# Altium project RFStamp.PrjPcb
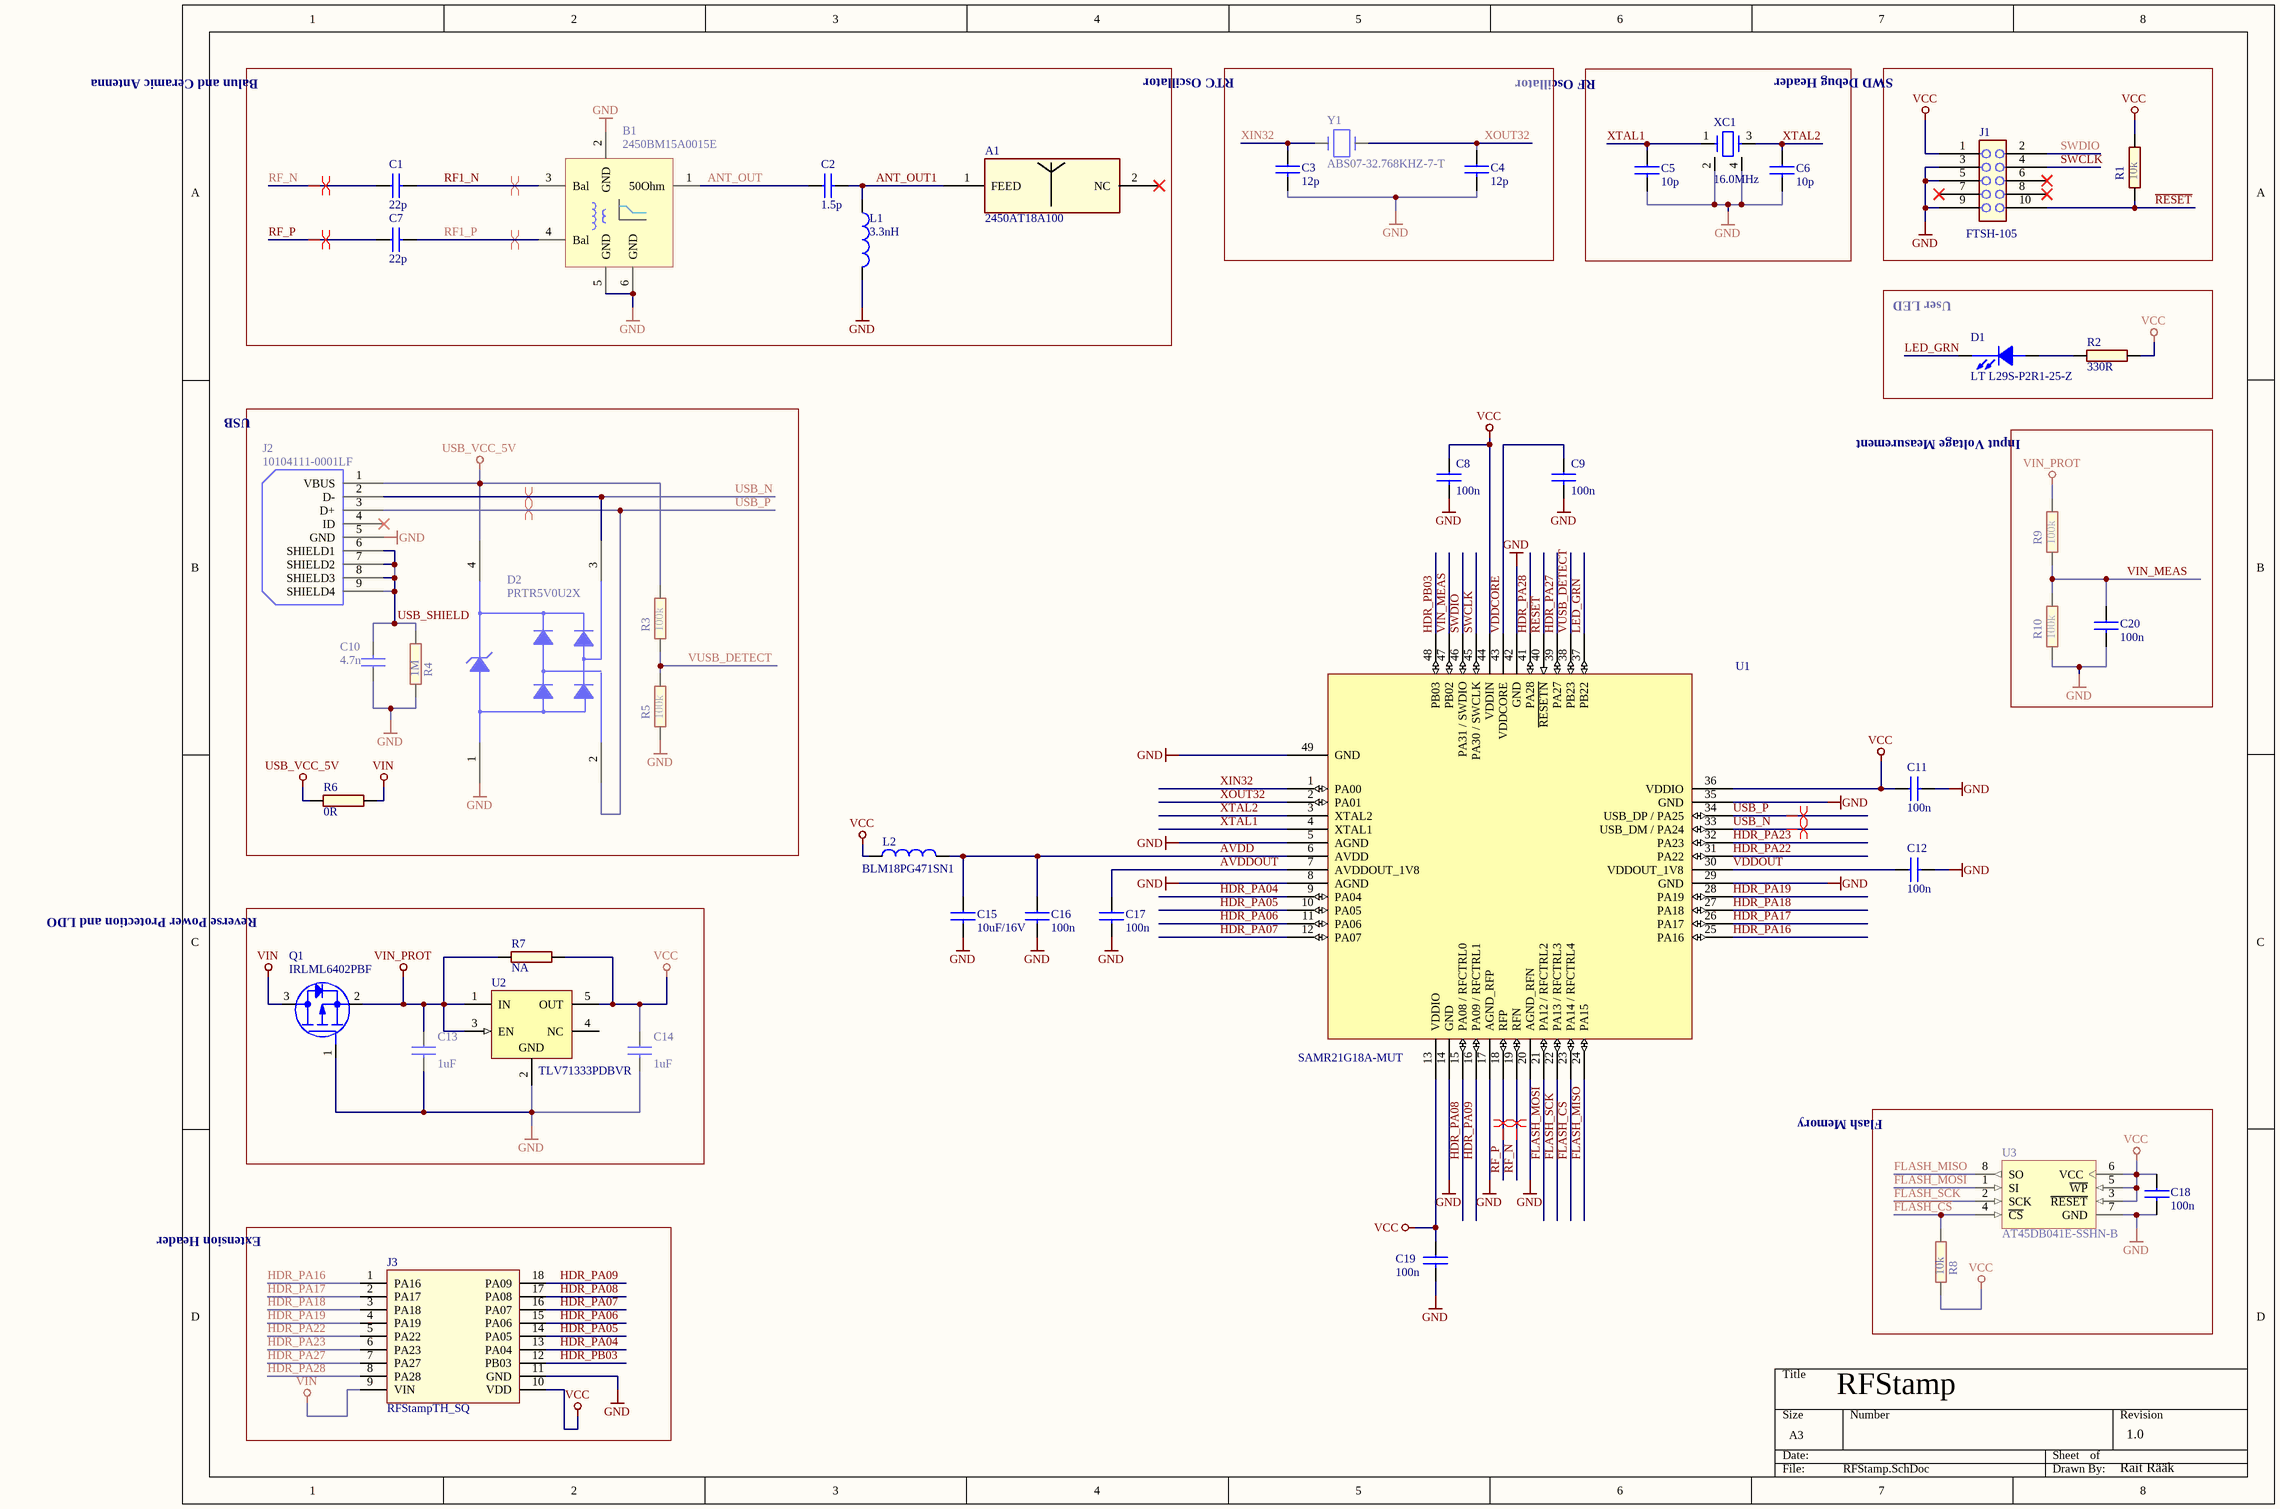
[diagram p0: RFStamp.SchDoc]
1 sheet, 45 parts. Net scope: global (net labels, ports and power ports of the same name join across sheets).
Board file: RFStamp.PcbDoc

## Sheet RFStamp.SchDoc: RFStamp
size A3; DrawnBy: Rait Rääk; Revision: 1.0; PageSetup: Record=PageOptions¦CenterHorizontal=True¦CenterVertical=True¦PrintScale=0.71¦XCorrection=1.00¦YCorrection=1.00¦PrintKind=0¦BorderSize=5000000¦LeftOffset=0¦BottomOffset=0¦Orientation=2¦PaperLength=1000¦PaperWidth=1000¦Scale=100¦PaperSource=7¦PrintQuality=-4¦MediaType=1¦DitherType=10¦PaperKind=A4¦PrintScaleMode=1

### Parts
A1  2450AT18A100  [2450AT18A100]
B1  2450BM15A0015E  [AP3-00060]
C1  22p  [AP1-00053]
C2  1.5p  [AP1-00053]
C3  12p  [AP1-00053]
C4  12p  [AP1-00053]
C5  10p  [AP1-00053]
C6  10p  [AP1-00053]
C7  22p  [AP1-00053]
C8  100n  [AP1-00053]
C9  100n  [AP1-00053]
C10  4.7n  [AP1-00053]
C11  100n  [AP1-00053]
C12  100n  [AP1-00053]
C13  1uF  [AP1-00039]
C14  1uF  [AP1-00039]
C15  10uF/16V  [AP1-00039]
C16  100n  [AP1-00053]
C17  100n  [AP1-00053]
C18  100n  [AP1-00053]
C19  100n  [AP1-00053]
C20  100n  [AP1-00053]
D1  LT L29S-P2R1-25-Z  [LS L29K]
D2  PRTR5V0U2X  [AP4-00001]
J1  FTSH-105  [FTSH_SMT_10]
J2  10104111-0001LF  [AP8-00604]
J3  RFStampTH_SQ  [RFSTAMP_TH_SQ]  (no BOM)
L1  3.3nH  [0402-A]
L2  BLM18PG471SN1  [AP3-00005]
Q1  IRLML6402PBF  [AP5-00002]
R1  10k  [AP2-00011]
R2  330R  [AP2-00011]
R3  100k  [AP2-00011]
R4  1M  [AP2-00011]
R5  100k  [AP2-00011]
R6  0R  [AP2-00011]
R7  value NA  [AP2-00011]  (hidden comment: 0R)  (no BOM)
R8  10k  [AP2-00011]
R9  100k  [AP2-00011]
R10  100k  [AP2-00011]
U1  SAMR21G18A-MUT  [AP6-00171]
U2  TLV71333PDBVR  [TI-DBV5_N]
U3  AT45DB041E-SSHN-B  [8S1_N]
XC1  value 16.0MHz  [AP7-00061]  (hidden comment: TSX-3225)
Y1  ABS07-32.768KHZ-7-T  [ABS07]

### Blocks framed on the sheet
Balun and Ceramic Antenna: A1 B1 C1 C2 C7 L1
RTC Oscillator: C3 C4 Y1
RF Oscillator: C5 C6 XC1
SWD Debug Header: J1 R1
User LED: D1 R2
USB: C10 D2 J2 R3-R6
Input Voltage Measurement: C20 R9 R10
Reverse Power Protection and LDO: C13 C14 Q1 R7 U2
Flash Memory: C18 R8 U3
Extension Header: J3

### Nets
GND: B1.2(GND) B1.5(GND) B1.6(GND) C3.2 C4.2 C5.2 C6.2 C8.2 C9.2 C10.1 C11.2 C12.2 C13.2 C14.2 C15.2 C16.2 C17.2 C18.2 C19.2 C20.2 D2.1(GND) J1.3 J1.5 J1.9 J2.5(GND) J3.11(GND) L1.2 Q1.1(G) R4.1 R5.1 R10.1 U1.5(AGND) U1.8(AGND) U1.14(GND) U1.17(AGND_RFP) U1.20(AGND_RFN) U1.29(GND) U1.35(GND) U1.42(GND) U1.49(GND) U2.2(GND) U3.7(GND) XC1.2(GND) XC1.4(GND)
USB_VCC_5V: D2.4(VCC) J2.1(VBUS) R3.2 R6.2
VCC: C8.1 C11.1 C14.1 C18.1 C19.1 J1.1 J3.10(VDD) L2.1 R1.2 R2.1 R7.1 R8.1 U1.13(VDDIO) U1.36(VDDIO) U1.44(VDDIN) U2.5(OUT) U3.3(~{RESET}) U3.5(~{WP}) U3.6(VCC)
VIN: J3.9(VIN) Q1.3(D) R6.1
VIN_PROT: C13.1 Q1.2(S) R7.2 R9.2 U2.1(IN) U2.3(EN)
ANT_OUT: B1.1(50Ohm) C2.1
ANT_OUT1: A1.1(FEED) C2.2 L1.1
AVDD: C15.1 C16.1 L2.2 U1.6(AVDD)
AVDDOUT: C17.1 U1.7(AVDDOUT_1V8)
~{FLASH_CS}: R8.2 U1.23(PA14_/_RFCTRL4) U3.4(~{CS})
FLASH_MISO: U1.24(PA15) U3.8(SO)
FLASH_MOSI: U1.21(PA12_/_RFCTRL2) U3.1(SI)
FLASH_SCK: U1.22(PA13_/_RFCTRL3) U3.2(SCK)
HDR_PA04: J3.13(PA04) U1.9(PA04)
HDR_PA05: J3.14(PA05) U1.10(PA05)
HDR_PA06: J3.15(PA06) U1.11(PA06)
HDR_PA07: J3.16(PA07) U1.12(PA07)
HDR_PA08: J3.17(PA08) U1.15(PA08_/_RFCTRL0)
HDR_PA09: J3.18(PA09) U1.16(PA09_/_RFCTRL1)
HDR_PA16: J3.1(PA16) U1.25(PA16)
HDR_PA17: J3.2(PA17) U1.26(PA17)
HDR_PA18: J3.3(PA18) U1.27(PA18)
HDR_PA19: J3.4(PA19) U1.28(PA19)
HDR_PA22: J3.5(PA22) U1.31(PA22)
HDR_PA23: J3.6(PA23) U1.32(PA23)
HDR_PA27: J3.7(PA27) U1.39(PA27)
HDR_PA28: J3.8(PA28) U1.41(PA28)
HDR_PB03: J3.12(PB03) U1.48(PB03)
LED_GRN: D1.1(CATHODE) U1.37(PB22)
~{RESET}: J1.10 R1.1 U1.40(~{RESETN})
RF1_N: B1.3(Bal) C1.2
RF1_P: B1.4(Bal) C7.2
RF_N: C1.1 U1.19(RFN)
RF_P: C7.1 U1.18(RFP)
SWCLK: J1.4 U1.45(PA30_/_SWCLK)
SWDIO: J1.2 U1.46(PA31_/_SWDIO)
USB_N: D2.3(I/O_2) J2.2(D-) U1.33(USB_DM_/_PA24)
USB_P: D2.2(I/O_1) J2.3(D+) U1.34(USB_DP_/_PA25)
USB_SHIELD: C10.2 J2.6(SHIELD1) J2.7(SHIELD2) J2.8(SHIELD3) J2.9(SHIELD4) R4.2
VDDCORE: C9.1 U1.43(VDDCORE)
VDDOUT: C12.1 U1.30(VDDOUT_1V8)
VIN_MEAS: C20.1 R9.1 R10.2 U1.47(PB02)
VUSB_DETECT: R3.1 R5.2 U1.38(PB23)
XIN32: C3.1 U1.1(PA00) Y1.1
XOUT32: C4.1 U1.2(PA01) Y1.2
XTAL1: C5.1 U1.4(XTAL1) XC1.1(IN)
XTAL2: C6.1 U1.3(XTAL2) XC1.3(OUT)
NetD1_2: D1.2(ANODE) R2.2

Not connected (* = marked no-connect by the designer): A1 2(NC)*; J1 6* 7* 8*; J2 4(ID)*; U2 4(NC)

### Layout directives
differential pair: RF1_N, RF1_P, RF_N, RF_P, USB_N, USB_P

### Library data of the parts
A1 = 2450AT18A100: Ceramic 2.45 GHz Antenna
B1 = A03-0091: Filtered Balun to match AT86RF232/233 (35288); Manufacturer: Johanson Technology; Value: 2450BM15A0015E
C1-C4 C6 C7 C11 C12 C16-C20 = A01-0246: Ceramic capacitor, SMD 0402, X7R, 16V, +/-10%; Manufacturer: Kemet; MPN: C0402C104K4RACTU; TemperatureRange: -55 - +125 deg C; Tolerance: 16V, +/-10%
  C1 C7: Value: 22p
  C2: Value: 1.5p
  C3 C4: Value: 12p
  C6: Value: 10p
  C11 C12 C16-C20: Value: 100n
C5 = A01-0246: Ceramic capacitor, SMD 0402, X7R, 16V, +/-10%; PartGroup: Capacitors,Ceramic,SMD 0402; Manufacturer: Kemet; MPN: C0402C104K4RACTU; TemperatureRange: -55 - +125 deg C; Value: 10p; Tolerance: 16V, +/-10%
C8 C9 = A01-0246: Ceramic capacitor, SMD 0402, X7R, 16V, +/-10%; PartGroup: Capacitors,Ceramic,SMD 0402; Manufacturer: Kemet; MPN: C0402C104K4RACTU; TemperatureRange: -55 - +125 deg C; ComponentStatus: 'Active (verified)'; Status: Active; Verified by: Lars Helge Mo; Verified date: 2005-12-15; AN: A01-0246; Value: 100n; Tolerance: 16V, +/-10%; Height: 0,5; FootprintStatus: 'Active (Verified)'
C10 = A01-0046: Ceramic capacitor, SMD 0402, X7R, 25V, +/-10%; TemperatureRange: -55 - +125 deg C; Value: 4.7n; Tolerance: 25V, +/-10%
C13 = A01-0377: Ceramic capacitor, SMD 0603, X5R, 10V, 10% (de31036); Manufacturer: tdk; MPN: C1608X5R1A475K; TemperatureRange: -55 - +85 deg C; Value: 1uF; Tolerance: 10%
C14 = A01-0377: Ceramic capacitor, SMD 0603, X5R, 6.3V, 10%; Manufacturer: tdk; MPN: C1608X5R1A475K; TemperatureRange: -55 - +85 deg C; Value: 1uF; Tolerance: 10%
C15 = A01-0491: Ceramic capacitor, SMD 0603, X5R, 16V, 10UF ± 20% (High Density); Manufacturer: Taiyo Yuden; MPN: EMK107BBJ106MA-T; Value: 10uF/16V
D1 = LS L29K
D2 = A06-0236: Double rail-to-rail USB ESD protection diode; Manufacturer: Philips; TemperatureRange: -40 to +85 C; Value: PRTR5V0U2X; MPN: PRTR5V0U2X
J1 = FTSH-105: CONN HEADER 10POS DUAL .05" SMD
J2 = A08-1368: Micro USB AB Connector; Manufacturer: FCI; Value: 10104111-0001LF; MPN: 10104111-0001LF
L1 = Inductor: Value: 3.3nH
L2 = A03-0035: SMD RF inductor 0603. Z=470Ohm (@100MHz), Max R(dc)=0.65Ohm, Max current=1A; Manufacturer: Murata; Tolerance: ±25%; TemperatureRange: -55°C to +125°C; Value: BLM18PG471SN1; MPN: BLM18PG471SN1
Q1 = A05-0087: P-ch. MOSFET. -30V, -3.7A continuous,RDS(ON)=0.05Ohm@VGS=-4,5V, RDS(ON)=0.08Ohm@VGS=-2.5V; Manufacturer: International Rectifier; TemperatureRange: -55 - +150 deg C; Value: IRLML6402PBF; MPN: IRLML6402PBF
R1 R3 R5 R6 R9 R10 = A02-0252: Thick film resistor, SMD 0402, 1/16W, 5%; TemperatureRange: -55 - +125 deg C; Tolerance: 5 %
  R1: Value: 10k
  R3 R5 R9 R10: Value: 100k
  R6: Value: 0R
R2 = A02-0200: Thick film resistor, SMD 0402, 1/16W, 5%; TemperatureRange: -55 - +125 deg C; Value: 330R; Tolerance: 5 %
R4 R8 = A02-0284: Thick film resistor, SMD 0402, 1/16W, 5%; Manufacturer: KOA; MPN: RK73H1ETTP1004F; TemperatureRange: -55 - +125 deg C; Tolerance: 5 %
  R4: Value: 1M
  R8: Value: 10k
R7 = A02-0252: Thick film resistor, SMD 0402, 1/16W, 5%; PartGroup: Resistors,SMD,0402 5%; TemperatureRange: -55 - +125 deg C; Tolerance: 5 %
U1 = SAMR21G: Atmel 32-bit Cortex M0+ MCU with RF233 SIP.; TemperatureRange: -40 to +85 deg celcius; Manufacturer: ATMEL; MPN: SAMR21G18A-MUT; Value: SAMR21G18A
U2 = TLV70233DBVR: Single Output LDO, 150 mA, Fixed 3.3 V Output, 2 to 5.5 V Input, with Low IQ, 5-pin SOT-23 (DBV), -40 to 85 degC, Green (RoHS & no Sb/Br); Manufacturer: Texas Instruments; Iout(Max)(A): 0.15; Iq(Typ)(mA): 0.03; Vdo(Typ)(mV): 220; Vin(Max)(V): 5.5; Vin(Min)(V): 2; Vout Adj(Max)(V): 3.3; Vout Adj(Min)(V): 3.3; PartNumber: TLV71333PDBVR
U3 = AT45DB041E: 4-Mbit DataFlash (with Extra 128-Kbits), 1.65V Minimum SPI Serial Flash Memory, 8-Pin SOIC
XC1 = TSX-3225: 16MHz uXtal, 3.2 x 2.5 mm SMD, CL=9pF, 15PPM, ESR=80ohm(Max.; Manufacturer: Epson Toyocom; MPN: TSX-3225 16.0000MF09Z-AC3; TemperatureRange: -40°C to +85°C; Tolerance: 15ppm
Y1 = ABS07: Low Profile Surface Mount Crystal